# EAGLE design TYPEI (EAGLE 9.6.2)
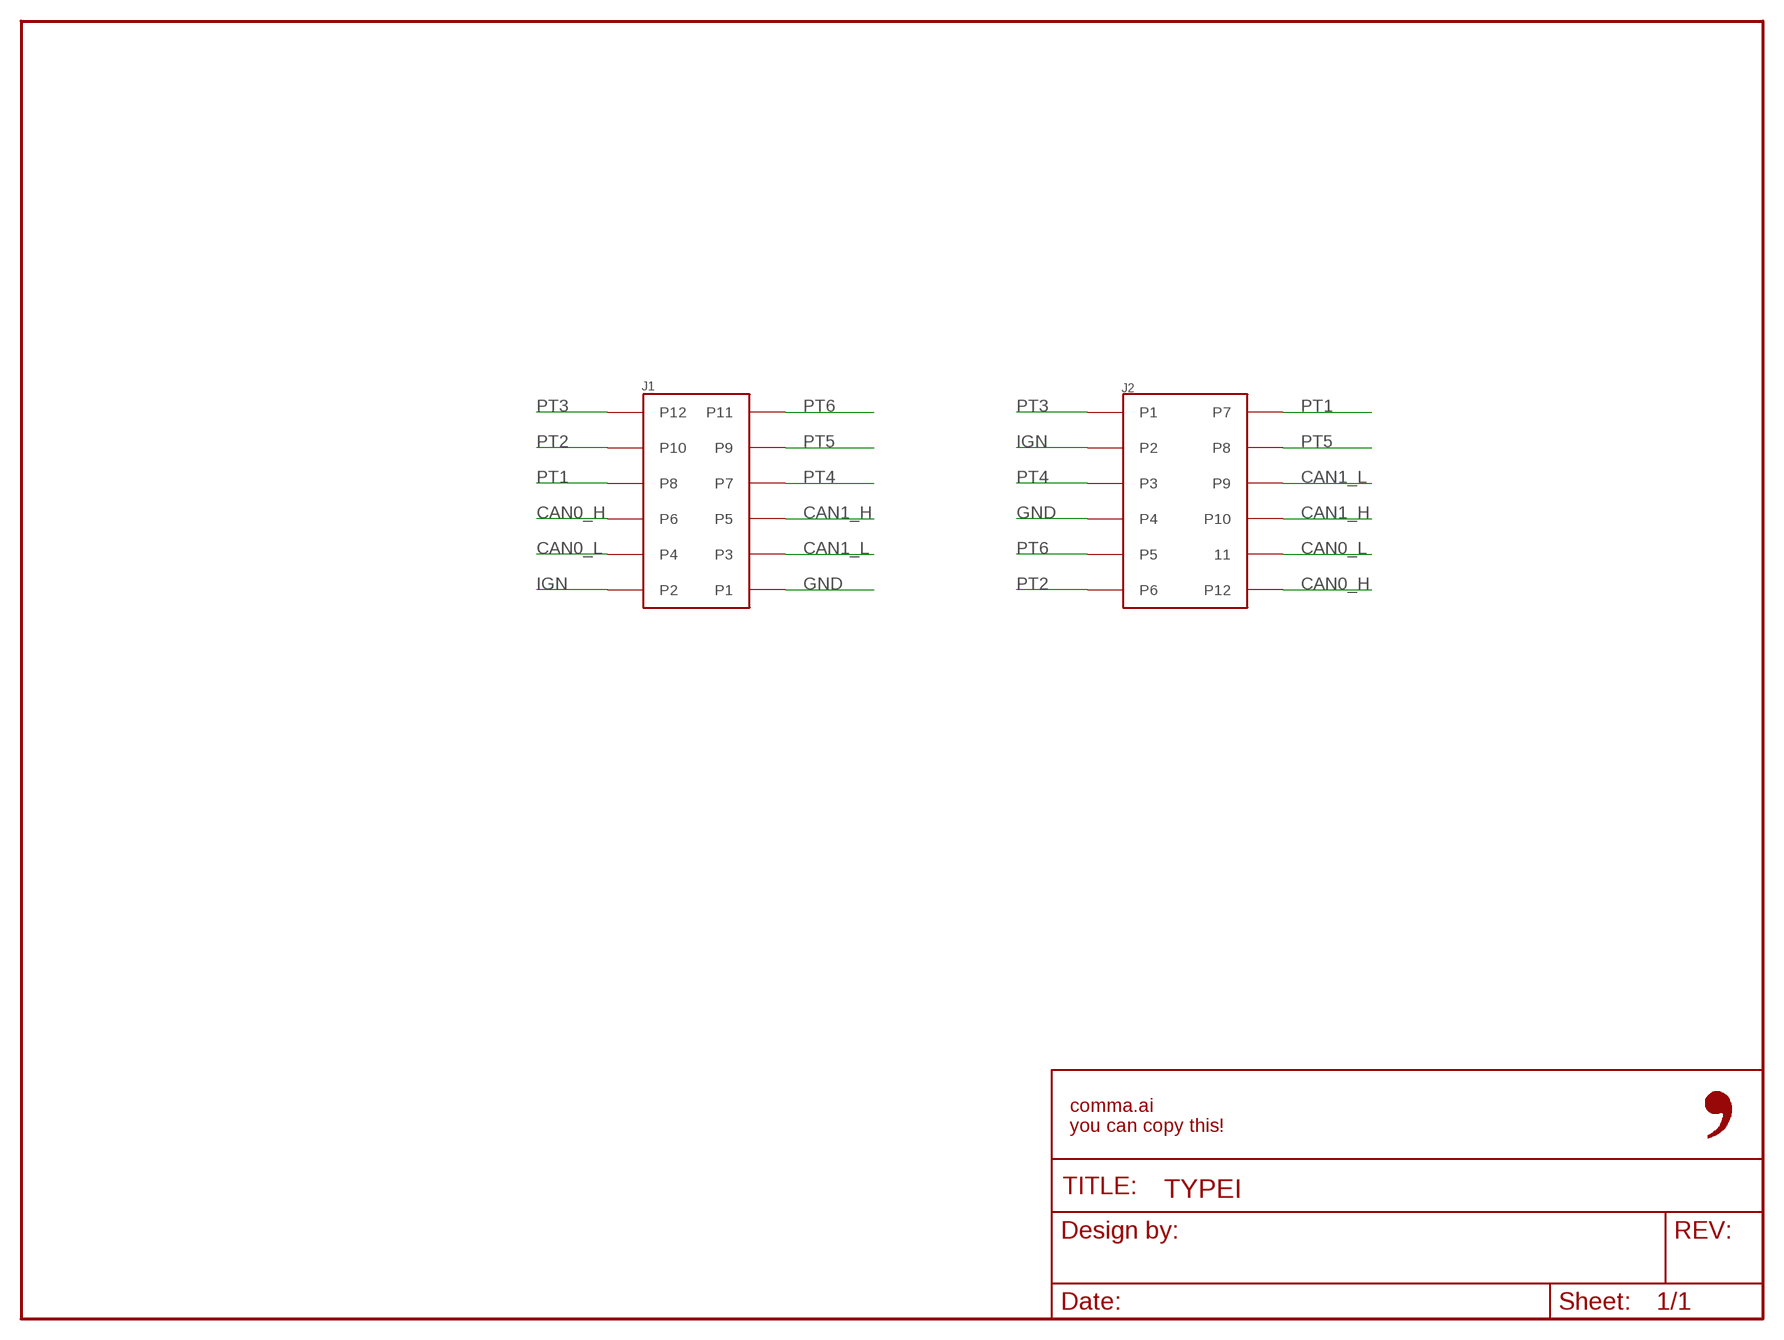
[diagram p0: schematic, sheet 1]

## Parts
FRAME1  FRAME-LETTER-OPENNO_PACKAGE  [DUMMY]
J1  5018761240  [5018761240]
J2  MG645845  [MG645845]

## Nets
CAN0_H: J1.P6 J2.P12
CAN0_L: J1.P4 J2.P11
CAN1_H: J1.P5 J2.P10
CAN1_L: J1.P3 J2.P9
GND: J1.P1 J2.P4
IGN: J1.P2 J2.P2
PT1: J1.P8 J2.P7
PT2: J1.P10 J2.P6
PT3: J1.P12 J2.P1
PT4: J1.P7 J2.P3
PT5: J1.P9 J2.P8
PT6: J1.P11 J2.P5

## Library data of the parts
FRAME1 = comma.ai:FRAME-LETTER-OPEN: Schematic Frame - Letter Standard 8.5x11 US Letter frame; DESIGNER: Nobody; VERSION: v01
J1 = 5018761440:5018761240; CPN: CAI-HARNESS-MOLEX-5018761240; MPN: 5018761240
J2 = MG645845:MG645845; CPN: CAI-HARNESS-KET-MG645845; MPN: MG645845

## Board
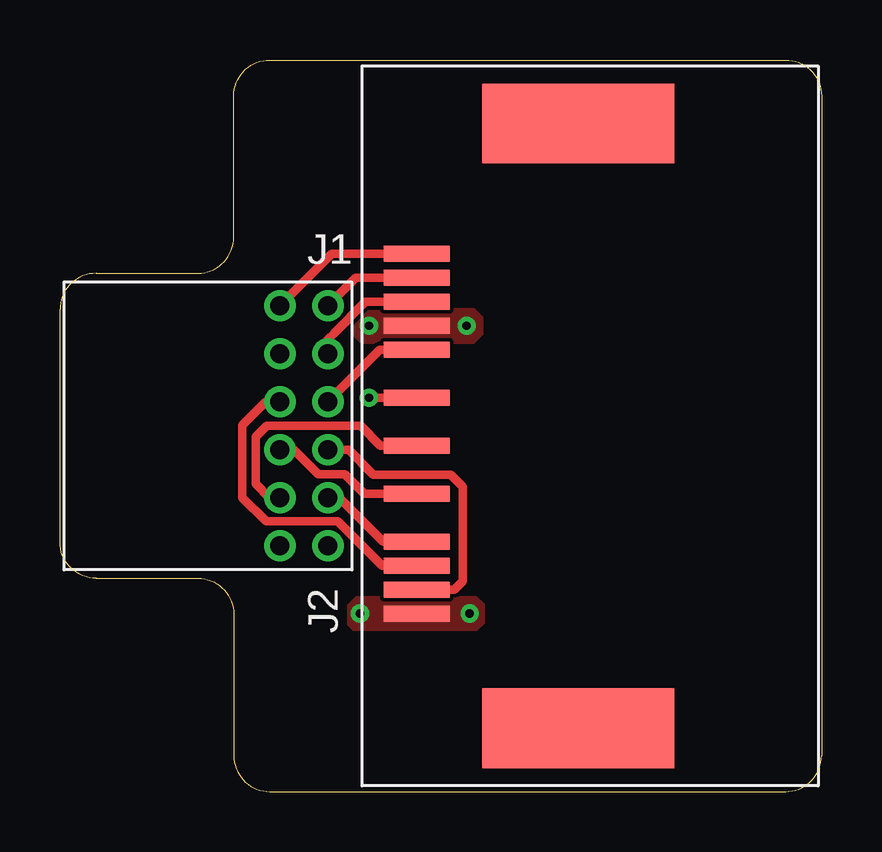
[diagram p1: board, top side]
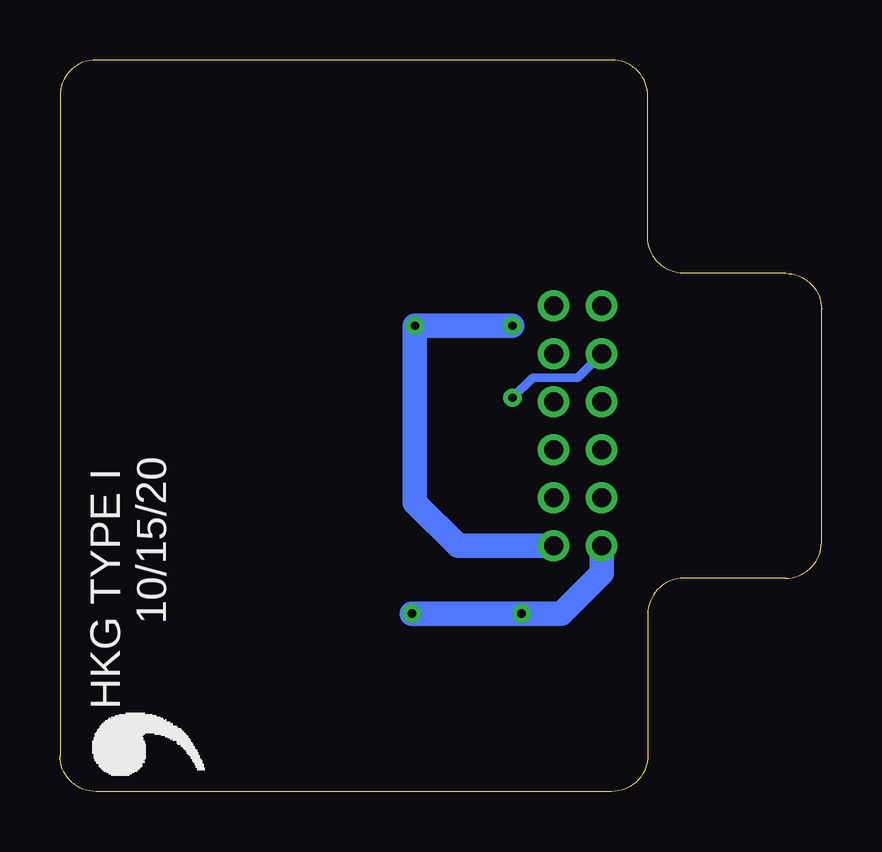
[diagram p2: board, bottom side, seen from below]

Size 31.73 x 30.48 mm. Coordinates in mm from the lower left corner, seen from the top.
Outline: 1.5,8.89 5.74,8.89 arc-90 7.24,7.39 7.24,1.5 arc90 8.74,0 30.23,0 arc90 31.73,1.5 31.73,28.98 arc90 30.23,30.48 8.74,30.48 arc90 7.24,28.98 7.24,23.09 arc-90 5.74,21.59 1.5,21.59 arc90 0,20.09 0,10.39 arc90 1.5,8.89
Copper layers (1*16): Top 0.035mm / dielectric 1.5mm / Bottom 0.035mm
Design rules "default": minimum track width 6mil, minimum drill 0.35mm, track to track 6mil, track to pad 6mil, pad to pad 6mil, via to via 6mil, smd to smd 6mil, copper to edge 40mil, drill to drill 6mil, minimum pad ring 10mil, minimum via ring 8mil, stop-mask expansion 4mil, vias tented up to drill 0mil, thermal gap 10mil

### Footprints (pad centres in the part's own frame; a part is rotated, then mirrored left to right if it is on the bottom)
5018761240 = drill 0.8: P1 5,-1; P2 5,1; P3 3,-1; P4 3,1; P5 1,-1; P6 1,1; P7 -1,-1; P8 -1,1; P9 -3,-1; P10 -3,1; P11 -5,-1; P12 -5,1
MG645845 = smd 0.66 x 2.75: P1 6.17,6.72; P2 4.17,6.72; P3 -5.83,6.72; P4 -7.83,6.72; P5 7.17,6.72; P6 5.17,6.72; P7 3.17,6.72; P8 1.17,6.72; P9 -0.83,6.72; P10 -2.83,6.72; P11 -4.83,6.72; P12 -6.83,6.72 | smd 3.32 x 8: P$1 -12.6,0; P$2 12.6,0

### Placement (x,y rotation side)
FRAME1  1.27,0 0 top
J1  10.16,15.24 270 top
J2  21.59,15.24 90 top
U$1  [LOGO]  25.4,0 90 bottom

### Tracks (layer width: path | path; a pad name or v marks a point on that pad's centre or on a via)
CAN0_H
  Top 0.356: J1.P6 12.02,14.24 13.06,13.21 16.28,13.21 16.79,12.7 16.79,8.76 16.44,8.41 J2.P12
CAN0_L
  Top 0.356: J1.P4 11.64,12.24 13.47,10.41 J2.P11
CAN1_H
  Top 0.356: J1.P5 9.74,14.24 10.75,13.22 11.87,13.22 12.69,12.41 J2.P10
CAN1_L
  Top 0.356: J2.P9 13.35,14.41 12.52,15.24 8.61,15.24 8.15,14.78 8.15,12.81 8.73,12.24 J1.P3
GND  (via drill 0.35)
  Bottom 1.016: J1.P1 9.16,9.1 9.77,8.5 10.85,7.42 v12.5,7.42 v17.07,7.42
  pour Top (no thermals): 17.32,8.08 12.37,8.08 12.04,7.75 12.04,6.96 12.24,6.76 17.35,6.76 17.63,7.04 17.63,7.77
IGN  (via drill 0.35)
  Bottom 1.016: J1.P2 15.14,10.24 16.94,12.04 v16.94,19.41 v12.88,19.41
  pour Top (no thermals): 12.6,20.07 12.22,19.68 12.22,19.08 12.57,18.72 17.22,18.72 17.58,19.08 17.58,19.74 17.25,20.07
PT1
  Top 0.356: J1.P8 13.33,18.41 J2.P7
PT2
  Top 0.356: J1.P10 11.15,18.84 11.4,19.08 12.73,20.41 J2.P6
PT3
  Top 0.356: J1.P12 12.33,21.41 J2.P1
PT4
  Top 0.356: J1.P7 8.57,16.24 7.59,15.27 7.59,12.24 8.59,11.25 11.58,11.25 13.43,9.41 J2.P3
PT5  (via drill 0.35)
  Top 0.356: v12.88,16.41 J2.P8
  Bottom 0.356: J1.P9 10.15,17.25 12.04,17.25 v12.88,16.41
PT6
  Top 0.356: J1.P11 11.33,22.41 J2.P5

### Text on the board
bNames: HKG TYPE I / 10/15/20